# Altium schematic sheet PowerWB.SchDoc: Fuente de alimentación
size A4; Author: Grupo 5; DrawnBy: Bruno Valinoti; SheetNumber: 1
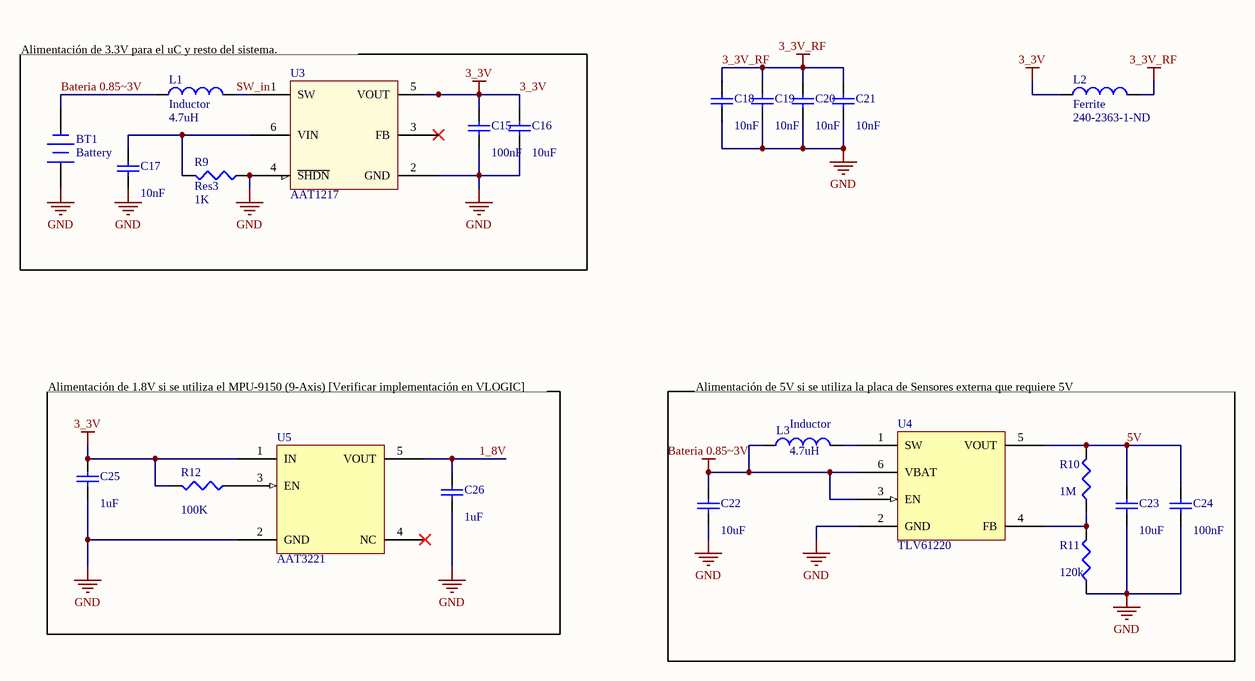
[diagram p0: PowerWB.SchDoc]

## Parts
BT1  Battery  [BAT-2]
C15  value 100nF  [1608[0603]]  (hidden comment: Cap Semi)
C16  value 10uF  [1608[0603]]  (hidden comment: Cap Semi)
C17  value 10nF  [1608[0603]]  (hidden comment: Cap Semi)
C18  value 10nF  [1608[0603]]  (hidden comment: Cap Semi)
C19  value 10nF  [1608[0603]]  (hidden comment: Cap Semi)
C20  value 10nF  [1608[0603]]  (hidden comment: Cap Semi)
C21  value 10nF  [1608[0603]]  (hidden comment: Cap Semi)
C22  value 10uF  [C0805]  (hidden comment: Cap Semi)
C23  value 10uF  [C0805]  (hidden comment: Cap Semi)
C24  value 100nF  [C0805]  (hidden comment: Cap Semi)
C25  value 1uF  [1608[0603]]  (hidden comment: Cap Semi)
C26  value 1uF  [1608[0603]]  (hidden comment: Cap Semi)
L1  Inductor  value 4.7uH  [0402-A]
L2  Ferrite  value 240-2363-1-ND  [0402-A]
L3  Inductor  value 4.7uH  [0402-A]
R9  Res3  value 1K  [6-0805_M]
R10  value 1M  [6-0805_M]  (hidden comment: Res3)
R11  value 120k  [6-0805_M]  (hidden comment: Res3)
R12  value 100K  [6-0805_M]  (hidden comment: Res3)
U3  AAT1217  [SOT26A-6N]
U4  TLV61220  [SOT26A-6N]
U5  AAT3221

## Nets
3_3V: C15.2 C16.2 C25.2 L2.1 R12.2 U3.5(VOUT) U5.1(IN)
3_3V_RF: C18.2 C19.2 C20.2 C21.2 L2.2
Bateria 0.85~3V: BT1.2(-) C22.2 L1.1 L3.1 U4.3(EN) U4.6(VBAT)
GND: BT1.1(+) C15.1 C16.1 C17.1 C18.1 C19.1 C20.1 C21.1 C22.1 C23.1 C24.1 C25.1 C26.1 R9.1 R11.1 U3.2(GND) U3.4(~{SHDN}) U4.2(GND) U5.2(GND)
1_8V: C26.2 U5.5(VOUT)
5V: C23.2 C24.2 R10.2 U4.5(VOUT)
SW_in: L1.2 U3.1(SW)
NetC17_2: C17.2 R9.2 U3.6(VIN)
NetL3_2: L3.2 U4.1(SW)
NetR10_1: R10.1 R11.2 U4.4(FB)
NetR12_1: R12.1 U5.3(EN)

Not connected (* = marked no-connect by the designer): U3 3(FB)*; U5 4(NC)*

## Notes on the sheet
- Alimentación de 3.3V para el uC y resto del sistema.
- Alimentación de 1.8V si se utiliza el MPU-9150 (9-Axis) [Verificar implementación en VLOGIC]
- Alimentación de 5V si se utiliza la placa de Sensores externa que requiere 5V
- Title
- Size:
- Date:
- A4
- Number:
- Time:
- Revision:
- Sheet
- of
- File:

## Library data of the parts
BT1 = Battery: Multicell Battery; Published: 24-Mar-1999; LatestRevisionDate: 17-Jul-2002; LatestRevisionNote: Re-released for DXP Platform.; PackageReference: BAT-2; Publisher: Altium Limited; PackageDescription: Battery; 2 Leads
C15-C26 = Cap Semi: Capacitor (Semiconductor SIM Model); Published: 8-Jun-2000; LatestRevisionDate: 29-May-2009; LatestRevisionNote: IPC-7351 Footprint Added.; PackageReference: C1206; Publisher: Altium Limited; PackageDescription: Chip Capacitor
L1-L3 = Inductor: Code_IEC: 1005; Published: 8-Jun-2000; LatestRevisionDate: 29-May-2009; LatestRevisionNote: IPC-7351 Footprint Added.; PackageReference: 0402-A; Publisher: Altium Limited; PackageDescription: Chip Inductor; Code_JEITA: 0402
R9-R12 = Res3: Resistor; Published: 8-Jun-2000; LatestRevisionDate: 29-May-2009; LatestRevisionNote: IPC-7351 Footprint Added.; PackageReference: J1-0603; Publisher: Altium Limited; PackageDescription: Chip Resistor
U4 = TLV61220: LOW INPUT VOLTAGE STEP-UP CONVERTER IN THIN SOT-23 PACKAGE
U5 = AAT3221: IC REG LDO 1.8V 0.15A SOT23-5